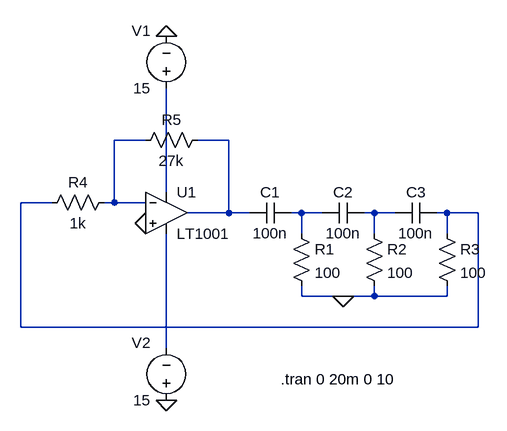
[diagram p0: schematic phase shift oscillator.asc]
phase shift oscillator.asc, the LTspice schematic file:
Version 4
SHEET 1 880 680
WIRE 96 112 48 112
WIRE 224 112 176 112
WIRE 128 192 128 32
WIRE -48 208 -96 208
WIRE 48 208 48 112
WIRE 48 208 32 208
WIRE 96 208 48 208
WIRE 224 224 224 112
WIRE 224 224 160 224
WIRE 256 224 224 224
WIRE 336 224 320 224
WIRE 368 224 336 224
WIRE 448 224 432 224
WIRE 480 224 448 224
WIRE 560 224 544 224
WIRE 608 224 560 224
WIRE 336 256 336 224
WIRE 448 256 448 224
WIRE 560 256 560 224
WIRE 336 352 336 336
WIRE 400 352 336 352
WIRE 448 352 448 336
WIRE 448 352 400 352
WIRE 560 352 560 336
WIRE 560 352 448 352
WIRE -96 400 -96 208
WIRE 608 400 608 224
WIRE 608 400 -96 400
WIRE 128 432 128 256
FLAG 128 -48 0
FLAG 128 512 0
FLAG 96 240 0
FLAG 400 352 0
SYMBOL Opamps\\LT1001 128 160 R0
SYMATTR InstName U1
SYMBOL voltage 128 48 R180
WINDOW 0 24 104 Left 0
WINDOW 3 24 16 Left 0
WINDOW 123 0 0 Left 0
WINDOW 39 0 0 Left 0
SYMATTR InstName V1
SYMATTR Value 15
SYMBOL voltage 128 528 R180
WINDOW 0 24 104 Left 0
WINDOW 3 24 16 Left 0
WINDOW 123 0 0 Left 0
WINDOW 39 0 0 Left 0
SYMATTR InstName V2
SYMATTR Value 15
SYMBOL res 48 192 R90
WINDOW 0 0 56 VBottom 0
WINDOW 3 32 56 VTop 0
SYMATTR InstName R4
SYMATTR Value 1k
SYMBOL res 192 96 R90
WINDOW 0 0 56 VBottom 0
WINDOW 3 32 56 VTop 0
SYMATTR InstName R5
SYMATTR Value 27k
SYMBOL cap 320 208 R90
WINDOW 0 0 32 VBottom 0
WINDOW 3 32 32 VTop 0
SYMATTR InstName C1
SYMATTR Value 100n
SYMBOL cap 432 208 R90
WINDOW 0 0 32 VBottom 0
WINDOW 3 32 32 VTop 0
SYMATTR InstName C2
SYMATTR Value 100n
SYMBOL cap 544 208 R90
WINDOW 0 0 32 VBottom 0
WINDOW 3 32 32 VTop 0
SYMATTR InstName C3
SYMATTR Value 100n
SYMBOL res 320 240 R0
SYMATTR InstName R1
SYMATTR Value 100
SYMBOL res 432 240 R0
SYMATTR InstName R2
SYMATTR Value 100
SYMBOL res 544 240 R0
SYMATTR InstName R3
SYMATTR Value 100
TEXT 304 480 Left 0 !.tran 0 20m 0 10

The netlist it stands for:
* phase shift oscillator.asc
XU1 0 N001 N003 N007 N002 LT1001  ; pins In+ In- V+ V- OUT
V1 N003 0 15
V2 0 N007 15
R4 N001 N004 1k
R5 N002 N001 27k
C1 N005 N002 100n
C2 N006 N005 100n
C3 N004 N006 100n
R1 N005 0 100
R2 N006 0 100
R3 N004 0 100
.tran 0 20m 0 10
.lib LTC.lib
.backanno
.end